# EAGLE schematic tc connecor test spacing 3 (EAGLE 6.5.0)
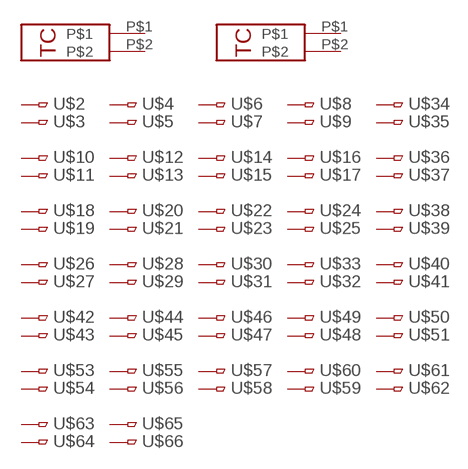
[diagram p0: schematic, sheet 1]

## Parts
U$1  TC-MINI-OUTSIDE  [TC-CLIP-OUTSIDE]
U$2  TC-MINI-SINGLE  [TC-CLIP-SINGLE]
U$3  TC-MINI-SINGLE  [TC-CLIP-SINGLE]
U$4  TC-MINI-SINGLE  [TC-CLIP-SINGLE]
U$5  TC-MINI-SINGLE  [TC-CLIP-SINGLE]
U$6  TC-MINI-SINGLE  [TC-CLIP-SINGLE]
U$7  TC-MINI-SINGLE  [TC-CLIP-SINGLE]
U$8  TC-MINI-SINGLE  [TC-CLIP-SINGLE]
U$9  TC-MINI-SINGLE  [TC-CLIP-SINGLE]
U$10  TC-MINI-SINGLE  [TC-CLIP-SINGLE]
U$11  TC-MINI-SINGLE  [TC-CLIP-SINGLE]
U$12  TC-MINI-SINGLE  [TC-CLIP-SINGLE]
U$13  TC-MINI-SINGLE  [TC-CLIP-SINGLE]
U$14  TC-MINI-SINGLE  [TC-CLIP-SINGLE]
U$15  TC-MINI-SINGLE  [TC-CLIP-SINGLE]
U$16  TC-MINI-SINGLE  [TC-CLIP-SINGLE]
U$17  TC-MINI-SINGLE  [TC-CLIP-SINGLE]
U$18  TC-MINI-SINGLE  [TC-CLIP-SINGLE]
U$19  TC-MINI-SINGLE  [TC-CLIP-SINGLE]
U$20  TC-MINI-SINGLE  [TC-CLIP-SINGLE]
U$21  TC-MINI-SINGLE  [TC-CLIP-SINGLE]
U$22  TC-MINI-SINGLE  [TC-CLIP-SINGLE]
U$23  TC-MINI-SINGLE  [TC-CLIP-SINGLE]
U$24  TC-MINI-SINGLE  [TC-CLIP-SINGLE]
U$25  TC-MINI-SINGLE  [TC-CLIP-SINGLE]
U$26  TC-MINI-SINGLE  [TC-CLIP-SINGLE]
U$27  TC-MINI-SINGLE  [TC-CLIP-SINGLE]
U$28  TC-MINI-SINGLE  [TC-CLIP-SINGLE]
U$29  TC-MINI-SINGLE  [TC-CLIP-SINGLE]
U$30  TC-MINI-SINGLE  [TC-CLIP-SINGLE]
U$31  TC-MINI-SINGLE  [TC-CLIP-SINGLE]
U$32  TC-MINI-SINGLE  [TC-CLIP-SINGLE]
U$33  TC-MINI-SINGLE  [TC-CLIP-SINGLE]
U$34  TC-MINI-SINGLE  [TC-CLIP-SINGLE]
U$35  TC-MINI-SINGLE  [TC-CLIP-SINGLE]
U$36  TC-MINI-SINGLE  [TC-CLIP-SINGLE]
U$37  TC-MINI-SINGLE  [TC-CLIP-SINGLE]
U$38  TC-MINI-SINGLE  [TC-CLIP-SINGLE]
U$39  TC-MINI-SINGLE  [TC-CLIP-SINGLE]
U$40  TC-MINI-SINGLE  [TC-CLIP-SINGLE]
U$41  TC-MINI-SINGLE  [TC-CLIP-SINGLE]
U$42  TC-MINI-SINGLE  [TC-CLIP-SINGLE]
U$43  TC-MINI-SINGLE  [TC-CLIP-SINGLE]
U$44  TC-MINI-SINGLE  [TC-CLIP-SINGLE]
U$45  TC-MINI-SINGLE  [TC-CLIP-SINGLE]
U$46  TC-MINI-SINGLE  [TC-CLIP-SINGLE]
U$47  TC-MINI-SINGLE  [TC-CLIP-SINGLE]
U$48  TC-MINI-SINGLE  [TC-CLIP-SINGLE]
U$49  TC-MINI-SINGLE  [TC-CLIP-SINGLE]
U$50  TC-MINI-SINGLE  [TC-CLIP-SINGLE]
U$51  TC-MINI-SINGLE  [TC-CLIP-SINGLE]
U$52  TC-MINI-INSIDE  [TC-CLIP-INSIDE]
U$53  TC-MINI-SINGLE  [TC-CLIP-SINGLE]
U$54  TC-MINI-SINGLE  [TC-CLIP-SINGLE]
U$55  TC-MINI-SINGLE  [TC-CLIP-SINGLE]
U$56  TC-MINI-SINGLE  [TC-CLIP-SINGLE]
U$57  TC-MINI-SINGLE  [TC-CLIP-SINGLE]
U$58  TC-MINI-SINGLE  [TC-CLIP-SINGLE]
U$59  TC-MINI-SINGLE  [TC-CLIP-SINGLE]
U$60  TC-MINI-SINGLE  [TC-CLIP-SINGLE]
U$61  TC-MINI-SINGLE  [TC-CLIP-SINGLE]
U$62  TC-MINI-SINGLE  [TC-CLIP-SINGLE]
U$63  TC-MINI-SINGLE  [TC-CLIP-SINGLE]
U$64  TC-MINI-SINGLE  [TC-CLIP-SINGLE]
U$65  TC-MINI-SINGLE  [TC-CLIP-SINGLE]
U$66  TC-MINI-SINGLE  [TC-CLIP-SINGLE]
Unconnected: U$1.P$1 U$1.P$2 U$2.P$1 U$3.P$1 U$4.P$1 U$5.P$1 U$6.P$1 U$7.P$1 U$8.P$1 U$9.P$1 U$10.P$1 U$11.P$1 U$12.P$1 U$13.P$1 U$14.P$1 U$15.P$1 U$16.P$1 U$17.P$1 U$18.P$1 U$19.P$1 U$20.P$1 U$21.P$1 U$22.P$1 U$23.P$1 U$24.P$1 U$25.P$1 U$26.P$1 U$27.P$1 U$28.P$1 U$29.P$1 U$30.P$1 U$31.P$1 U$32.P$1 U$33.P$1 U$34.P$1 U$35.P$1 U$36.P$1 U$37.P$1 U$38.P$1 U$39.P$1 U$40.P$1 U$41.P$1 U$42.P$1 U$43.P$1 U$44.P$1 U$45.P$1 U$46.P$1 U$47.P$1 U$48.P$1 U$49.P$1 U$50.P$1 U$51.P$1 U$52.P$1 U$52.P$2 U$53.P$1 U$54.P$1 U$55.P$1 U$56.P$1 U$57.P$1 U$58.P$1 U$59.P$1 U$60.P$1 U$61.P$1 U$62.P$1 U$63.P$1 U$64.P$1 U$65.P$1 U$66.P$1

## Library data of the parts
U$1 = PaxInstruments-Connectors:TC-MINI-OUTSIDE
U$2-U$51 U$53-U$66 = PaxInstruments-Connectors:TC-MINI-SINGLE; MF: Pax Instrument; MPN: Thermo-clip2
U$52 = PaxInstruments-Connectors:TC-MINI-INSIDE; MF: Pax Instrument; MPN: Thermo-clip2